# EAGLE design borg16ctrl-V2 (EAGLE 4.16)
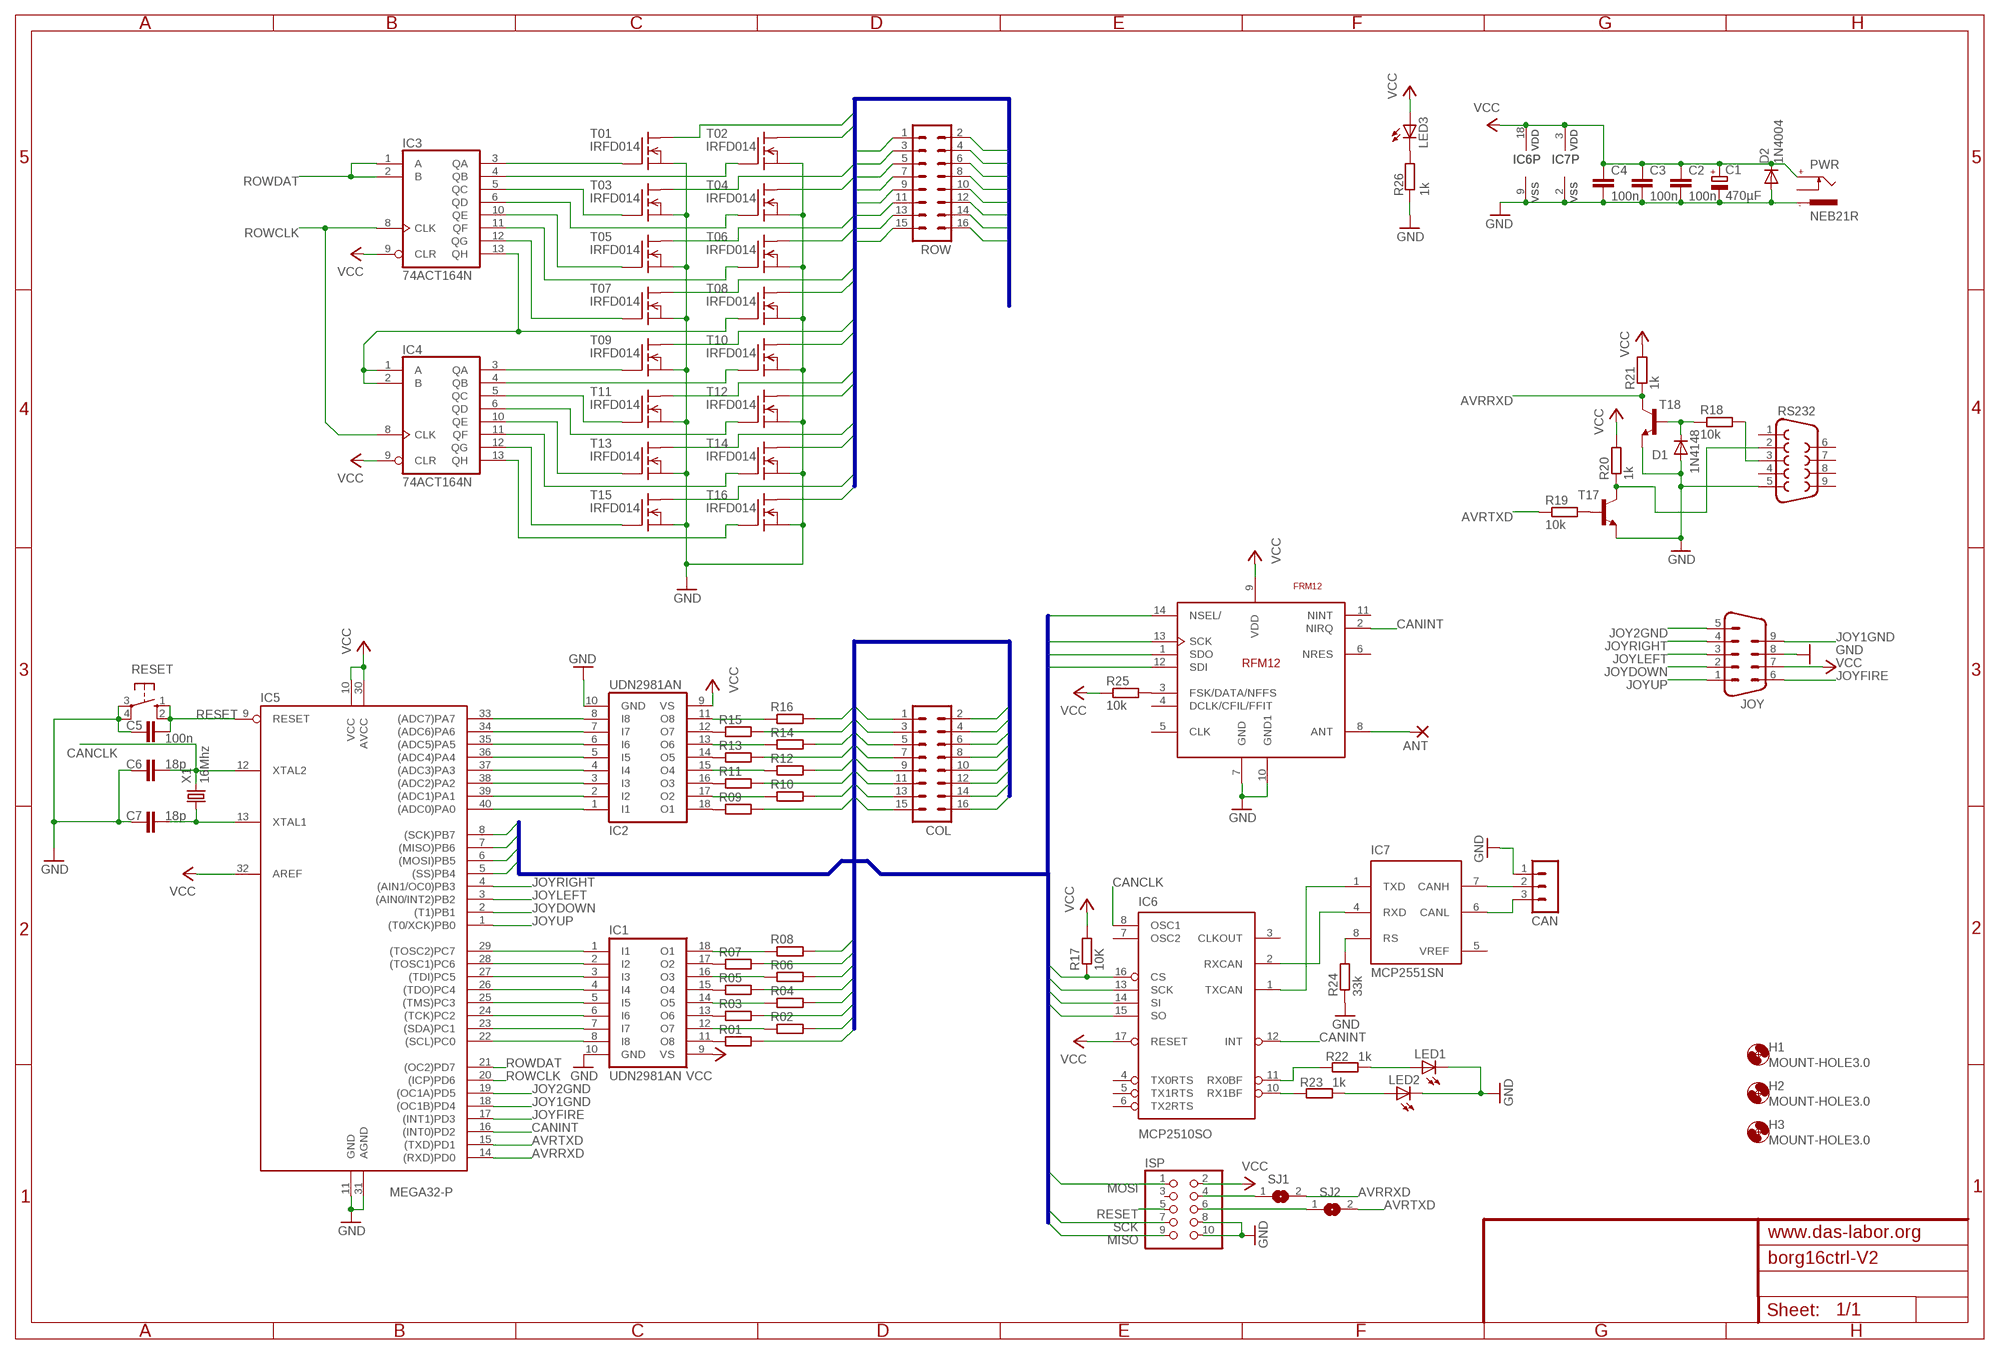
[diagram p0: schematic, sheet 1]

## Parts
ANT  2,54/1,0  [2,54/1,0]
C1  470µF  CPOL-EUE3.5-8  [E3,5-8]
C2  100n  C-EU025-025X050  [C025-025X050]
C3  100n  C-EU025-025X050  [C025-025X050]
C4  100n  C-EU025-025X050  [C025-025X050]
C5  100n  C-EU025-025X050  [C025-025X050]
C6  18p  C-EU025-025X050  [C025-025X050]
C7  18p  C-EU025-025X050  [C025-025X050]
CAN  MA03-1  [MA03-1]
COL  ML16  [ML16]
D1  1N4148  DIODE-D-2.5  [D-2.5]
D2  1N4004  [DO41-10]
H1  MOUNT-HOLE3.0  [3,0]
H2  MOUNT-HOLE3.0  [3,0]
H3  MOUNT-HOLE3.0  [3,0]
IC1  UDN2981AN  [DIL18]
IC2  UDN2981AN  [DIL18]
IC3  74ACT164N  [DIL14]
IC4  74ACT164N  [DIL14]
IC5  MEGA32-P  [DIL40]
IC6  MCP2510SO  [SO-18W]
IC7  MCP2551SN  [SO-08]
IC8  FRM12  [RFM12]
ISP  PINHD-2X5  [2X05]
JOY  M09HP  [M09HP]
LED1  LED5MM  [LED5MM]
LED2  LED5MM  [LED5MM]
LED3  LED3MM  [LED3MM]
PWR  NEB21R  [NEB21R]
R01  R-EU_0204/7  [0204/7]
R02  R-EU_0204/7  [0204/7]
R03  R-EU_0204/7  [0204/7]
R04  R-EU_0204/7  [0204/7]
R05  R-EU_0204/7  [0204/7]
R06  R-EU_0204/7  [0204/7]
R07  R-EU_0204/7  [0204/7]
R08  R-EU_0204/7  [0204/7]
R09  R-EU_0204/7  [0204/7]
R10  R-EU_0204/7  [0204/7]
R11  R-EU_0204/7  [0204/7]
R12  R-EU_0204/7  [0204/7]
R13  R-EU_0204/7  [0204/7]
R14  R-EU_0204/7  [0204/7]
R15  R-EU_0204/7  [0204/7]
R16  R-EU_0204/7  [0204/7]
R17  10K  R-EU_0204/7  [0204/7]
R18  10k  R-EU_0204/7  [0204/7]
R19  10k  R-EU_0204/7  [0204/7]
R20  1k  R-EU_0204/7  [0204/7]
R21  1k  R-EU_0204/7  [0204/7]
R22  1k  R-EU_0204/7  [0204/7]
R23  1k  R-EU_0204/7  [0204/7]
R24  33k  R-EU_R1206  [R1206]
R25  10k  R-EU_0204/7  [0204/7]
R26  1k  R-EU_0204/7  [0204/7]
RESET  10-XX  [B3F-10XX]
ROW  ML16  [ML16]
RS232  F09HP  [F09HP]
SJ1  SJ  [SJ]
SJ2  SJ  [SJ]
T01  IRFD014  [DIL04]
T02  IRFD014  [DIL04]
T03  IRFD014  [DIL04]
T04  IRFD014  [DIL04]
T05  IRFD014  [DIL04]
T06  IRFD014  [DIL04]
T07  IRFD014  [DIL04]
T08  IRFD014  [DIL04]
T09  IRFD014  [DIL04]
T10  IRFD014  [DIL04]
T11  IRFD014  [DIL04]
T12  IRFD014  [DIL04]
T13  IRFD014  [DIL04]
T14  IRFD014  [DIL04]
T15  IRFD014  [DIL04]
T16  IRFD014  [DIL04]
T17  BC547B-NPN-TO92-EBC  [TO92-EBC]
T18  BC547B-NPN-TO92-EBC  [TO92-EBC]
X1  16Mhz  CRYTALHC49U-V  [HC49U-V]

## Nets
$34: IC1.14(O5) R04.1
AVRRXD: IC5.14((RXD)PD0) R21.1 SJ1.2 T18.C
AVRTXD: IC5.15((TXD)PD1) R19.1 SJ2.2
CANCLK: C6.2 IC5.12(XTAL2) IC6.8(OSC1) X1.2
CANINT: IC5.16((INT0)PD2) IC6.12(INT) IC8.2(NIRQ)
COL1: COL.1 R01.2
COL2: COL.2 R02.2
COL3: COL.3 R03.2
COL4: COL.4 R04.2
COL5: COL.5 R05.2
COL6: COL.6 R06.2
COL7: COL.7 R07.2
COL8: COL.8 R08.2
COL9: COL.9 R09.2
COL10: COL.10 R10.2
COL11: COL.11 R11.2
COL12: COL.12 R12.2
COL13: COL.13 R13.2
COL14: COL.14 R14.2
COL15: COL.15 R15.2
COL16: COL.16 R16.2
FET11: IC4.4(QB) T10.3(G)
GND: C1.- C2.2 C3.2 C4.2 C5.1 C6.1 C7.1 CAN.1 D1.A D2.A IC1.10(GND) IC2.10(GND) IC5.11(GND) IC5.31(AGND) IC6.9(VSS) IC7.2(VSS) IC8.7(GND) IC8.10(GND1) ISP.8 ISP.10 JOY.8 LED1.K(C) LED2.K(C) PWR.- R24.1 R26.1 RESET.3(P) RESET.4(P1) RS232.5 T01.4(S) T02.4(S) T03.4(S) T04.4(S) T05.4(S) T06.4(S) T07.4(S) T08.4(S) T09.4(S) T10.4(S) T11.4(S) T12.4(S) T13.4(S) T14.4(S) T15.4(S) T16.4(S) T17.E T18.E
IC7: IC6.2(RXCAN) IC7.4(RXD)
JOY1GND: IC5.18((OC1B)PD4) JOY.9
JOY2GND: IC5.19((OC1A)PD5) JOY.5
JOYDOWN: IC5.2((T1)PB1) JOY.2
JOYFIRE: IC5.17((INT1)PD3) JOY.6
JOYLEFT: IC5.3((AIN0/INT2)PB2) JOY.3
JOYRIGHT: IC5.4((AIN1/OC0)PB3) JOY.4
JOYUP: IC5.1((T0/XCK)PB0) JOY.1
MISO: IC5.7((MISO)PB6) IC6.15(SO) IC8.1(SDO) ISP.9
MOSI: IC5.6((MOSI)PB5) IC6.14(SI) IC8.12(SDI) ISP.1
N$1: IC1.1(I1) IC5.29((TOSC2)PC7)
N$2: IC1.2(I2) IC5.28((TOSC1)PC6)
N$3: IC1.3(I3) IC5.27((TDI)PC5)
N$4: IC1.4(I4) IC5.26((TDO)PC4)
N$5: IC1.5(I5) IC5.25((TMS)PC3)
N$6: IC1.6(I6) IC5.24((TCK)PC2)
N$7: IC1.7(I7) IC5.23((SDA)PC1)
N$8: IC1.8(I8) IC5.22((SCL)PC0)
N$9: IC2.1(I1) IC5.40((ADC0)PA0)
N$10: IC2.2(I2) IC5.39((ADC1)PA1)
N$11: IC2.3(I3) IC5.38((ADC2)PA2)
N$12: IC2.4(I4) IC5.37((ADC3)PA3)
N$13: IC2.5(I5) IC5.36((ADC4)PA4)
N$14: IC2.6(I6) IC5.35((ADC5)PA5)
N$15: IC2.7(I7) IC5.34((ADC6)PA6)
N$16: IC2.8(I8) IC5.33((ADC7)PA7)
N$17: IC1.17(O2) R07.1
N$18: IC1.15(O4) R05.1
N$19: IC1.13(O6) R03.1
N$20: IC1.11(O8) R01.1
N$21: IC2.18(O1) R09.1
N$22: IC2.16(O3) R11.1
N$23: IC2.14(O5) R13.1
N$24: IC2.12(O7) R15.1
N$25: IC2.11(O8) R16.1
N$26: IC2.13(O6) R14.1
N$27: IC2.15(O4) R12.1
N$28: IC2.17(O2) R10.1
N$29: D1.C R18.1 T18.B
N$30: IC1.16(O3) R06.1
N$31: ISP.4 SJ1.1
N$32: IC1.12(O7) R02.1
N$33: IC3.3(QA) T01.3(G)
N$34: IC3.4(QB) T02.3(G)
N$35: IC3.5(QC) T03.3(G)
N$36: IC3.6(QD) T04.3(G)
N$37: IC3.10(QE) T05.3(G)
N$38: IC3.11(QF) T06.3(G)
N$39: IC3.12(QG) T07.3(G)
N$40: IC3.13(QH) IC4.1(A) IC4.2(B) T08.3(G)
N$41: IC4.3(QA) T09.3(G)
N$42: R18.2 RS232.3
N$43: IC4.5(QC) T11.3(G)
N$44: IC4.6(QD) T12.3(G)
N$45: IC4.10(QE) T13.3(G)
N$46: IC4.11(QF) T14.3(G)
N$47: IC4.12(QG) T15.3(G)
N$48: IC4.13(QH) T16.3(G)
N$49: LED1.A R22.2
N$50: LED2.A R23.2
N$51: IC6.10(RX1BF) R23.1
N$52: IC6.11(RX0BF) R22.1
N$53: CAN.2 IC7.7(CANH)
N$54: IC6.1(TXCAN) IC7.1(TXD)
N$55: IC8.3(FSK/DATA/NFFS) R25.2
N$56: IC7.8(RS) R24.2
N$57: CAN.3 IC7.6(CANL)
N$58: ISP.6 SJ2.1
N$59: C7.2 IC5.13(XTAL1) X1.1
N$60: R20.1 RS232.2 T17.C
N$61: R19.2 T17.B
N$62: LED3.K(C) R26.2
N$63: ANT.1(P) IC8.8(ANT)
R08: IC1.18(O1) R08.1
RESET: C5.2 IC5.9(RESET) ISP.5 RESET.1(S) RESET.2(S1)
ROW1: ROW.1 T01.2(D1)
ROW2: ROW.2 T02.2(D1)
ROW3: ROW.3 T03.2(D1)
ROW4: ROW.4 T04.2(D1)
ROW5: ROW.5 T05.2(D1)
ROW6: ROW.6 T06.2(D1)
ROW7: ROW.7 T07.2(D1)
ROW8: ROW.8 T08.2(D1)
ROW9: ROW.9 T09.2(D1)
ROW10: ROW.10 T10.2(D1)
ROW11: ROW.11 T11.2(D1)
ROW12: ROW.12 T12.2(D1)
ROW13: ROW.13 T13.2(D1)
ROW14: ROW.14 T14.2(D1)
ROW15: ROW.15 T15.2(D1)
ROW16: ROW.16 T16.2(D1)
ROWCLK: IC3.8(CLK) IC4.8(CLK) IC5.20((ICP)PD6)
ROWDAT: IC3.1(A) IC3.2(B) IC5.21((OC2)PD7)
SCK: IC5.8((SCK)PB7) IC6.13(SCK) IC8.13(SCK) ISP.7
SS: IC5.5((SS)PB4) IC6.16(CS) IC8.14(NSEL/) R17.1
VCC: C1.+ C2.1 C3.1 C4.1 D2.C IC1.9(VS) IC2.9(VS) IC3.9(CLR) IC4.9(CLR) IC5.10(VCC) IC5.30(AVCC) IC5.32(AREF) IC6.17(RESET) IC6.18(VDD) IC7.3(VDD) IC8.9(VDD) ISP.2 JOY.7 LED3.A PWR.+ R17.2 R20.2 R21.2 R25.1
Unconnected: IC6.3(CLKOUT) IC6.4(TX0RTS) IC6.5(TX1RTS) IC6.6(TX2RTS) IC6.7(OSC2) IC8.4(DCLK/CFIL/FFIT) IC8.5(CLK) IC8.6(NRES) IC8.11(NINT) ISP.3 PWR.C RS232.1 RS232.4 RS232.6 RS232.7 RS232.8 RS232.9 T01.1(D) T02.1(D) T03.1(D) T04.1(D) T05.1(D) T06.1(D) T07.1(D) T08.1(D) T09.1(D) T10.1(D) T11.1(D) T12.1(D) T13.1(D) T14.1(D) T15.1(D) T16.1(D)

## Buses
COLUMS:COL1,COL2,COL3,COL4,COL5,COL6,COL7,COL8,COL9,COL10,COL11,COL12,COL13,COL14,COL15,COL16
ROWS:ROW1,ROW2,ROW3,ROW4,ROW5,ROW6,ROW7,ROW8,ROW9,ROW10,ROW11,ROW12,ROW13,ROW14,ROW15,ROW16
SPI:SCK,MISO,MOSI,SS

## Notes on the sheet
- www.das-labor.org

## Power pins joined to a net without a drawn wire
GND: IC3.7(GND) IC4.7(GND)
VCC: IC3.14(VCC) IC4.14(VCC)
VREF: IC7.5(VREF)

## Library data of the parts
ANT = wirepad:2,54/1,0: THROUGH-HOLE PAD
C1 = rcl:CPOL-EU: POLARIZED CAPACITOR, European symbol
C2-C7 = rcl:C-EU: CAPACITOR, European symbol
CAN = con-lstb:MA03-1: PIN HEADER
COL ROW = con-harting-ml:ML16: HARTING
D1 = diode:DIODE-: DIODE
D2 = diode:1N4004: DIODE general purpose rectifier, 1 A
H1-H3 = holes:MOUNT-HOLE: MOUNTING HOLE with drill center marker
IC1 IC2 = uln-udn:UDN2981A: DRIVER ARRAY
IC3 IC4 = 74xx-eu:74*164: 8-bit parallel out SHIFT REGISTER
IC5 = atmel:MEGA32-P: MICROCONTROLLER 32 Kbytes FLASH 2 Kbytes SRAM 1 Kbytes EEPROM USART 8-channel 10 bit ADC
IC6 = microchip_can:MCP2510
IC7 = microchip_can:MCP2551: High Speed CAN tranceiver
IC8 = RFM12:FRM12
ISP = pinhead:PINHD-2X5: PIN HEADER
JOY = con-subd:M09: SUB-D
LED1-LED3 = led:LED: LED OSRAM: - CHIPLED LG R971, LG N971, LY N971, LG Q971, LY Q971, LO R971, LY R971 LH N974, LH R974 LS Q976, LO Q976, LY Q976 LO Q996 - Hyper CHIPLED LW Q18S LB Q993, LB Q99A, LB R99A - SideLED LS A670, LO A670, LY A670, LG A670, LP A670 LB A673, LV A673, LT A673, LW A673 LH A674 LY A675 LS A676, LA A676, LO A676, LY A676, LW A676 LS A679, LY A679, LG A679 - Hyper Micro SIDELED® LS Y876, LA Y876, LO Y876, LY Y876 LT Y87S - SmartLED LW L88C, LW L88S LB L89C, LB L89S, LG L890 LS L89K, LO L89K, LY L89K LS L896, LA L896, LO L896, LY L896 - TOPLED LS T670, LO T670, LY T670, LG T670, LP T670 LSG T670, LSP T670, LSY T670, LOP T670, LYG T670 LG T671, LOG T671, LSG T671 LB T673, LV T673, LT T673, LW T673 LH T674 LS T676, LA T676, LO T676, LY T676, LB T676, LH T676, LSB T676, LW T676 LB T67C, LV T67C, LT T67C, LS T67K, LO T67K, LY T67K, LW E67C LS E67B, LA E67B, LO E67B, LY E67B, LB E67C, LV E67C, LT E67C LW T67C LS T679, LY T679, LG T679 LS T770, LO T770, LY T770, LG T770, LP T770 LB T773, LV T773, LT T773, LW T773 LH T774 LS E675, LA E675, LY E675, LS T675 LS T776, LA T776, LO T776, LY T776, LB T776 LHGB T686 LT T68C, LB T68C - Hyper Mini TOPLED® LB M676 - Mini TOPLED Santana® LG M470 LS M47K, LO M47K, LY M47K Source: http://www.osram.convergy.de/
PWR = con-lumberg:NEB21R: Klinkeneinbaukupplung
R01-R09 R10-R26 = rcl:R-EU_: RESISTOR, European symbol
RESET = switch-omron:10-XX: OMRON SWITCH
RS232 = con-subd:F09: SUB-D
SJ1 SJ2 = jumper:SJ: SMD solder JUMPER
T01-T09 T10-T16 = irfd014:IRFD014
T17 T18 = transistor:*-NPN-: NPN Transistror
X1 = crystal:CRYTAL: CRYSTAL

## Board
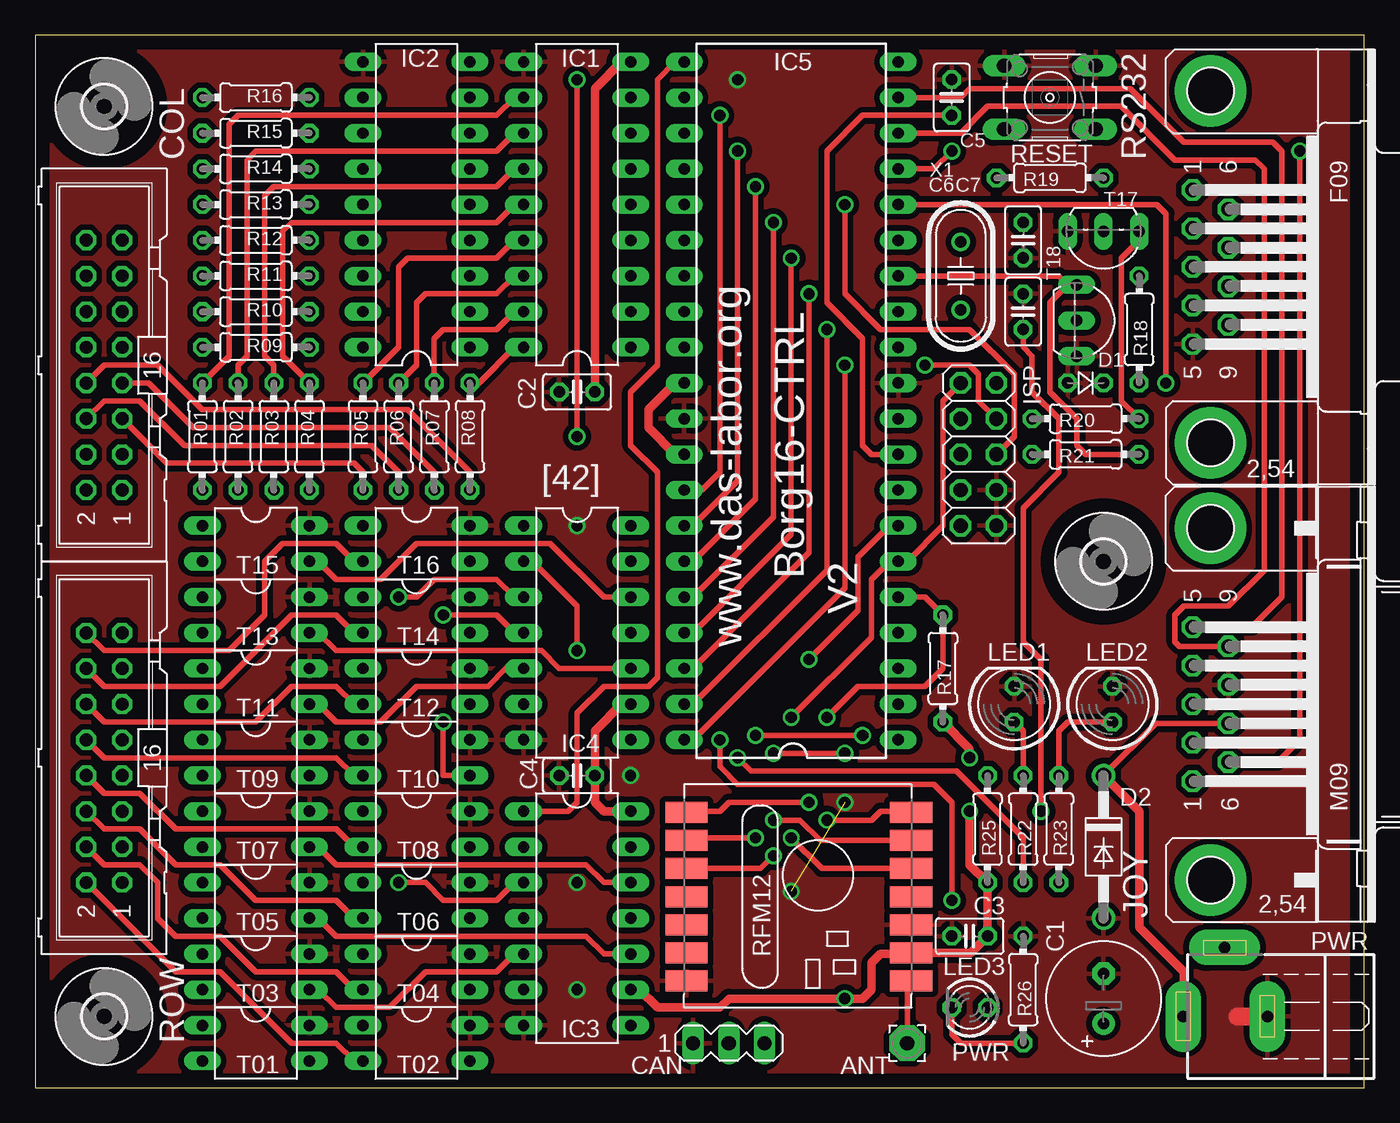
[diagram p1: board, top side]
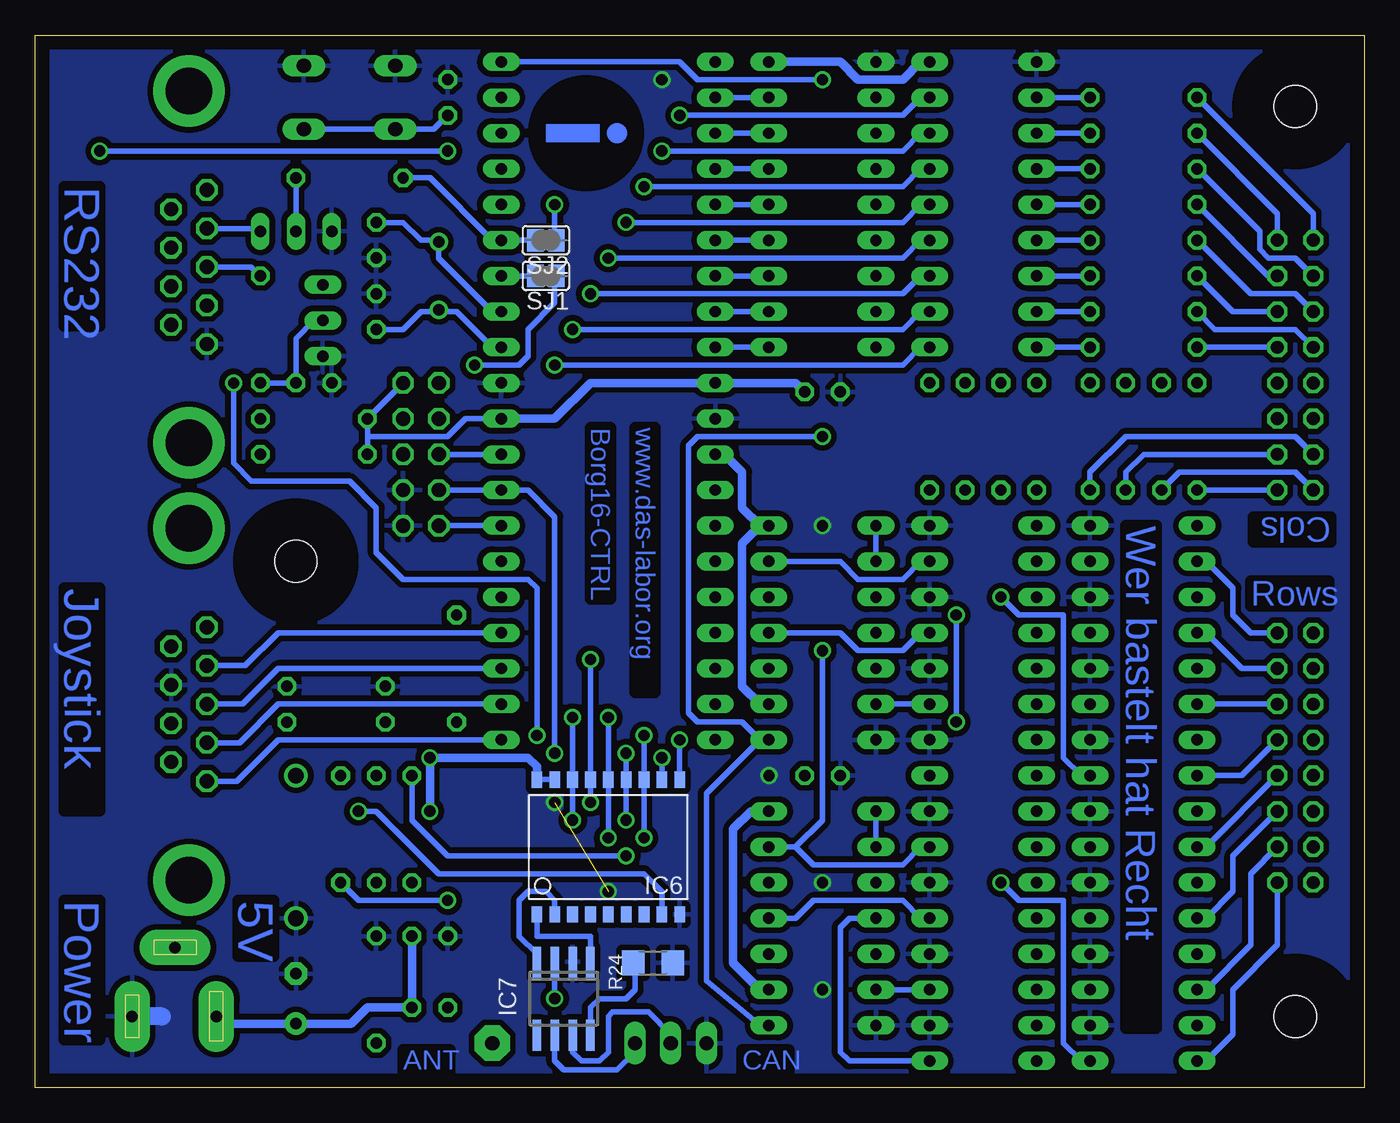
[diagram p2: board, bottom side, seen from below]

Size 94.6 x 74.92 mm. Coordinates in mm from the lower left corner, seen from the top.
Outline: 0,0 94.6,0 94.6,74.92 0,74.92 0,0
Copper layers (1*16): Top 0.035mm / dielectric 1.5mm / Bottom 0.035mm
Design rules "default": minimum track width 10mil, minimum drill 24mil, track to track 8mil, track to pad 8mil, pad to pad 8mil, via to via 8mil, smd to smd 8mil, copper to edge 40mil, drill to drill 8mil, minimum pad ring 10mil, minimum via ring 8mil, stop-mask expansion 4mil, vias tented up to drill 0mil, thermal gap 16mil
bRestrict: area 51.7,64.2 to 59.1,71.7

### Footprints (pad centres in the part's own frame; a part is rotated, then mirrored left to right if it is on the bottom)
2,54/1,0 = drill 1.016 pad 2.54 octagon: 1 0,0
E3,5-8 = drill 0.813 pad 1.6 round: + -1.778,0 | drill 0.813 pad 1.6 octagon: - 1.778,0
C025-025X050 = drill 0.813 octagon: 1 -1.27,0; 2 1.27,0
MA03-1 = drill 1.016 long: 1 -2.54,0; 2 0,0; 3 2.54,0
ML16 = drill 0.914 octagon: 1 -8.89,-1.27; 2 -8.89,1.27; 3 -6.35,-1.27; 4 -6.35,1.27; 5 -3.81,-1.27; 6 -3.81,1.27; 7 -1.27,-1.27; 8 -1.27,1.27; 9 1.27,-1.27; 10 1.27,1.27; 11 3.81,-1.27; 12 3.81,1.27; 13 6.35,-1.27; 14 6.35,1.27; 15 8.89,-1.27; 16 8.89,1.27
D-2.5 = drill 0.813 octagon: A 1.27,0; C -1.27,0
DO41-10 = drill 1.118 round: A 5.08,0; C -5.08,0
3,0 = hole 3: 0,0
DIL18 = drill 0.813 long: 1 -10.16,-3.81; 2 -7.62,-3.81; 3 -5.08,-3.81; 4 -2.54,-3.81; 5 0,-3.81; 6 2.54,-3.81; 7 5.08,-3.81; 8 7.62,-3.81; 9 10.16,-3.81; 10 10.16,3.81; 11 7.62,3.81; 12 5.08,3.81; 13 2.54,3.81; 14 0,3.81; 15 -2.54,3.81; 16 -5.08,3.81; 17 -7.62,3.81; 18 -10.16,3.81
DIL14 = drill 0.813 long: 1 -7.62,-3.81; 2 -5.08,-3.81; 3 -2.54,-3.81; 4 0,-3.81; 5 2.54,-3.81; 6 5.08,-3.81; 7 7.62,-3.81; 8 7.62,3.81; 9 5.08,3.81; 10 2.54,3.81; 11 0,3.81; 12 -2.54,3.81; 13 -5.08,3.81; 14 -7.62,3.81
DIL40 = drill 0.813 long: 1 -24.13,-7.62; 2 -21.59,-7.62; 3 -19.05,-7.62; 4 -16.51,-7.62; 5 -13.97,-7.62; 6 -11.43,-7.62; 7 -8.89,-7.62; 8 -6.35,-7.62; 9 -3.81,-7.62; 10 -1.27,-7.62; 11 1.27,-7.62; 12 3.81,-7.62; 13 6.35,-7.62; 14 8.89,-7.62; 15 11.43,-7.62; 16 13.97,-7.62; 17 16.51,-7.62; 18 19.05,-7.62; 19 21.59,-7.62; 20 24.13,-7.62; 21 24.13,7.62; 22 21.59,7.62; 23 19.05,7.62; 24 16.51,7.62; 25 13.97,7.62; 26 11.43,7.62; 27 8.89,7.62; 28 6.35,7.62; 29 3.81,7.62; 30 1.27,7.62; 31 -1.27,7.62; 32 -3.81,7.62; 33 -6.35,7.62; 34 -8.89,7.62; 35 -11.43,7.62; 36 -13.97,7.62; 37 -16.51,7.62; 38 -19.05,7.62; 39 -21.59,7.62; 40 -24.13,7.62
SO-18W = smd 0.762 x 1.143: 1 -5.08,-4.788; 2 -3.81,-4.788; 3 -2.54,-4.788; 4 -1.27,-4.788; 5 0,-4.788; 6 1.27,-4.788; 7 2.54,-4.788; 8 3.81,-4.788; 9 5.08,-4.788; 10 5.08,4.788; 11 3.81,4.788; 12 2.54,4.788; 13 1.27,4.788; 14 0,4.788; 15 -1.27,4.788; 16 -2.54,4.788; 17 -3.81,4.788; 18 -5.08,4.788
SO-08 = smd 0.6 x 2.2: 1 -1.905,-2.6; 2 -0.635,-2.6; 3 0.635,-2.6; 4 1.905,-2.6; 5 1.905,2.6; 6 0.635,2.6; 7 -0.635,2.6; 8 -1.905,2.6
RFM12 = smd 1.5 x 3: 1 -5,-10; 2 -3,-10; 3 -1,-10; 4 1,-10; 5 3,-10; 6 5,-10; 7 7,-10; 8 7,6; 9 5,6; 10 3,6; 11 1,6; 12 -1,6; 13 -3,6; 14 -5,6
2X05 = drill 1.016 octagon: 1 -5.08,-1.27; 2 -5.08,1.27; 3 -2.54,-1.27; 4 -2.54,1.27; 5 0,-1.27; 6 0,1.27; 7 2.54,-1.27; 8 2.54,1.27; 9 5.08,-1.27; 10 5.08,1.27
M09HP = drill 1.016 octagon: 1 -5.486,1.27; 2 -2.743,1.27; 3 0,1.27; 4 2.743,1.27; 5 5.486,1.27; 6 -4.115,-1.27; 7 -1.372,-1.27; 8 1.372,-1.27; 9 4.115,-1.27 | drill 3.302 pad 5.08 round: G1 -12.522,0; G2 12.522,0
LED5MM = drill 0.813 octagon: A -1.27,0; K 1.27,0
LED3MM = drill 0.813 octagon: A -1.27,0; K 1.27,0
NEB21R = drill 0.813 pad 2.54 long: + 0,7.35; - 0,1.35; C 4.9,4.4
0204/7 = drill 0.813 octagon: 1 -3.81,0; 2 3.81,0
R1206 = smd 1.6 x 1.8: 1 -1.4,0; 2 1.4,0
B3F-10XX = drill 1.016 long: 1 -3.251,2.261; 2 3.251,2.261; 3 -3.251,-2.261; 4 3.251,-2.261
F09HP = drill 1.016 octagon: 1 -5.486,-1.27; 2 -2.743,-1.27; 3 0,-1.27; 4 2.743,-1.27; 5 5.486,-1.27; 6 -4.115,1.27; 7 -1.372,1.27; 8 1.372,1.27; 9 4.115,1.27 | drill 3.302 pad 5.08 round: G1 -12.522,0; G2 12.522,0
SJ = smd 1.168 x 1.6: 1 -0.762,0; 2 0.762,0
DIL04 = drill 0.813 long: 1 -1.27,-3.81; 2 1.27,-3.81; 3 1.27,3.81; 4 -1.27,3.81
TO92-EBC = drill 0.813 long: B 0,-1.27; C -2.54,-1.27; E 2.54,-1.27
HC49U-V = drill 0.813 round: 1 -2.413,0; 2 2.413,0

### Placement (x,y rotation side)
ANT  62.06,3.17 0 top
C1  76.03,6.34 90 top
C2  38.57,49.52 180 top
C3  66.51,10.79 180 top
C4  38.57,22.22 180 top
C5  65.24,70.48 270 top
C6  70.32,55.24 270 top
C7  70.32,60.32 90 top
CAN  49.37,3.17 0 top
COL  4.92,51.43 90 top
D1  74.77,50.16 180 top
D2  76.03,17.14 270 top
H1  4.92,69.84 0 top
H2  4.92,5.08 0 top
H3  76.03,37.46 0 top
IC1  38.57,62.86 90 top
IC2  27.14,62.86 90 top
IC3  38.57,12.06 270 top
IC4  38.57,32.38 270 top
IC5  53.81,48.89 90 top
IC6  53.81,17.14 0 bottom
IC7  56.98,6.34 180 bottom
IC8  56.35,14.6 270 top
ISP  67.14,45.08 270 top
JOY  83.66,27.3 90 top
LED1  69.69,27.3 90 top
LED2  76.67,27.3 90 top
LED3  66.51,5.71 180 top
PWR  89.05,5.08 90 top
R01  11.9,46.35 270 top
R02  14.44,46.35 270 top
R03  16.98,46.35 270 top
R04  19.52,46.35 270 top
R05  23.33,46.35 270 top
R06  25.87,46.35 270 top
R07  28.41,46.35 270 top
R08  30.95,46.35 270 top
R09  15.71,52.7 180 top
R10  15.71,55.24 180 top
R11  15.71,57.78 180 top
R12  15.71,60.32 180 top
R13  15.71,62.86 180 top
R14  15.71,65.4 180 top
R15  15.71,67.94 180 top
R16  15.71,70.48 180 top
R17  64.61,29.84 270 top
R18  78.58,53.97 90 top
R19  72.22,64.77 0 top
R20  74.77,47.62 180 top
R21  74.77,45.08 180 top
R22  70.32,18.41 90 top
R23  72.86,18.41 90 top
R24  50.63,8.88 180 bottom
R25  67.78,18.41 90 top
R26  70.32,6.98 270 top
RESET  72.22,70.48 180 top
ROW  4.92,23.49 90 top
RS232  83.66,58.41 270 top
SJ1  58.25,57.78 180 bottom
SJ2  58.25,60.32 180 bottom
T01  15.71,3.17 270 top
T02  27.14,3.17 270 top
T03  15.71,8.25 270 top
T04  27.14,8.25 270 top
T05  15.71,13.33 270 top
T06  27.14,13.33 270 top
T07  15.71,18.41 270 top
T08  27.14,18.41 270 top
T09  15.71,23.49 270 top
T10  27.14,23.49 270 top
T11  15.71,28.57 270 top
T12  27.14,28.57 270 top
T13  15.71,33.65 270 top
T14  27.14,33.65 270 top
T15  15.71,38.73 270 top
T16  27.14,38.73 270 top
T17  76.03,59.69 180 top
T18  75.4,54.61 270 top
X1  65.88,57.78 270 top

### Tracks (layer width: path | path; a pad name or v marks a point on that pad's centre or on a via)
$34
  Top 0.406: R04.1 17.61,52.06 17.61,60.95 18.25,61.59 32.85,61.59 34.12,62.86 IC1.14
AVRRXD
  Top 0.406: 73.5,57.15 72.22,55.88 72.22,49.52 74.13,47.62 74.13,45.72 74.77,45.08 R21.1 | 73.5,57.15 T18.C | 73.5,57.15 72.86,57.78 IC5.14
  Bottom 0.406: SJ1.2 IC5.14
AVRTXD
  Bottom 0.406: R19.1 66.51,64.77 62.06,60.32 IC5.15 SJ2.2
CANCLK  (via drill 0.8)
  Top 0.406: v71.59,19.68 71.59,30.48 70.32,31.75 70.32,41.27 72.86,43.81 72.86,47.62 70.95,49.52 70.95,52.06 70.32,52.7 C6.2
  Bottom 0.406: IC5.12 62.06,52.7 64.61,55.24 65.88,55.24 | C6.2 68.41,53.97 67.14,55.24 65.88,55.24 | 65.88,55.24 X1.2 | IC6.8 50,13.96 51.27,15.24 65.88,15.24 70.32,19.68 v71.59,19.68
CANINT  (via drill 0.8)
  Top 0.406: IC5.16 79.84,62.86 80.48,62.23 v80.48,50.16 | v51.27,25.08 v58.89,25.08 | IC8.2 46.19,17.6 46.19,17.78 v51.27,17.78
  Bottom 0.406: v80.48,50.16 80.48,44.45 79.21,43.17 72.22,43.17 70.32,41.27 70.32,38.09 68.41,36.19 59.52,36.19 58.89,35.55 v58.89,25.08 | v51.27,17.78 IC6.12 v51.27,25.08
COL1
  Bottom 0.406: COL.1 R01.2
COL2
  Bottom 0.406: R02.2 13.17,43.81 4.92,43.81 COL.2
COL3
  Bottom 0.406: R03.2 16.98,43.81 15.71,45.08 COL.3
COL4
  Bottom 0.406: R04.2 19.52,43.81 16.98,46.35 4.92,46.35 COL.4
COL5
  Top 0.406: COL.5 9.36,44.45 22.7,44.45 23.33,43.81 R05.2
COL6
  Top 0.406: COL.6 4.92,48.89 7.46,48.89 10.63,45.72 23.96,45.72 25.87,43.81 R06.2
COL7
  Top 0.406: COL.7 8.09,50.16 11.27,46.98 25.23,46.98 28.41,43.81 R07.2
COL8
  Top 0.406: COL.8 4.92,51.43 8.73,51.43 11.9,48.26 26.5,48.26 30.95,43.81 R08.2
COL9
  Bottom 0.406: COL.9 R09.2
COL10
  Bottom 0.406: COL.10 4.92,53.97 10.63,53.97 R10.2
COL11
  Bottom 0.406: R11.2 9.36,55.24 COL.11
COL12
  Bottom 0.406: COL.12 4.92,56.51 8.09,56.51 R12.2
COL13
  Bottom 0.406: COL.13 6.82,57.78 R13.2
COL14
  Bottom 0.406: COL.14 4.92,59.05 6.82,59.05 7.46,59.69 7.46,60.95 R14.2
COL15
  Bottom 0.406: COL.15 6.18,62.23 R15.2
COL16
  Bottom 0.406: COL.16 3.64,62.23 R16.2
FET11  (via drill 0.8)
  Top 0.406: T10.3 29.04,22.22 v29.04,26.03 | v29.04,33.65 32.85,33.65 34.12,32.38 IC4.4
  Bottom 0.406: v29.04,26.03 v29.04,33.65
GND  (via drill 0.8)  (1 unrouted)
  Top 1.27: 85.56,5.08 87.47,5.08
  Bottom 1.27: 85.56,5.08 87.47,5.08
  other vias: 38.57,6.98 42.38,22.22 38.57,40 50,71.75 57.62,20.32 38.57,14.6 53.81,13.96
  pour Bottom (isolate 0.406): -0.17,-0.01 95.4,-0.01 95.4,74.92 -0.17,74.92
  pour Top (isolate 0.406): -0.17,74.92 95.4,74.92 95.4,-0.01 -0.17,-0.01
IC7
  Bottom 0.406: IC7.4 58.89,9.52 60.16,10.79 60.16,13.33 59.52,13.96 58.25,13.96 57.62,13.33 IC6.2 57.62,12.06
JOY1GND
  Top 0.406: IC5.18 65.88,67.94 67.78,69.84 77.3,69.84 81.11,66.03 86.83,66.03 87.47,65.4 87.47,36.83 84.92,34.29 81.75,34.29 81.11,33.65 81.11,31.75 81.44,31.41 JOY.9
JOY2GND
  Top 0.406: IC5.19 65.88,70.48 66.51,71.11 77.94,71.11 81.75,67.31 88.1,67.31 88.73,66.67 88.73,34.92 86.6,32.79 JOY.5
JOYDOWN
  Bottom 0.406: JOY.2 80.05,24.56 77.3,27.3 IC5.2
JOYFIRE  (via drill 0.8)
  Top 0.406: JOY.6 88.43,23.19 90,24.76 v90,66.67 | IC5.17 63.97,65.4 v65.24,66.67
  Bottom 0.406: v90,66.67 v65.24,66.67
JOYLEFT
  Bottom 0.406: IC5.3 77.3,29.84 79.84,27.3 JOY.3
JOYRIGHT
  Bottom 0.406: IC5.4 77.3,32.38 79.64,30.04 JOY.4
JOYUP
  Bottom 0.406: IC5.1 77.3,24.76 80.25,21.81 JOY.1
MISO  (via drill 0.8)
  Top 0.406: v55.08,30.48 58.57,33.97 58.57,37.78 60.8,40 IC5.7 | v55.08,20.32 49.37,20.32 48.73,19.68 46.19,19.68 46.27,19.6 IC8.1
  Bottom 0.406: IC5.7 ISP.9 | v55.08,30.48 IC6.15 v55.08,20.32
MOSI  (via drill 0.8)
  Top 0.406: v53.81,26.35 59.52,32.06 59.52,36.19 60.8,37.46 IC5.6 62.06,37.46 64.61,40 64.61,48.89 ISP.1 | IC8.12 55.98,15.6 v53.81,17.78
  Bottom 0.406: v53.81,17.78 IC6.14 v53.81,26.35
N$1
  Bottom 0.406: IC1.1 IC5.29
N$2
  Bottom 0.406: IC1.2 IC5.28
N$3
  Bottom 0.406: IC1.3 IC5.27
N$4
  Bottom 0.406: IC1.4 IC5.26
N$5
  Bottom 0.406: IC1.5 IC5.25
N$6
  Bottom 0.406: IC1.6 IC5.24
N$7
  Bottom 0.406: IC1.7 IC5.23
N$8
  Bottom 0.406: IC1.8 IC5.22
N$9  (via drill 0.8)
  Top 0.406: v57.62,51.43 57.62,35.55 46.82,24.76 IC5.40
  Bottom 0.406: IC2.1 31.58,52.7 32.85,51.43 v57.62,51.43
N$10  (via drill 0.8)
  Top 0.406: v56.35,53.97 56.35,36.83 46.82,27.3 IC5.39
  Bottom 0.406: IC2.2 31.58,55.24 32.85,53.97 v56.35,53.97
N$11  (via drill 0.8)
  Top 0.406: v55.08,56.51 55.08,38.09 46.82,29.84 IC5.38
  Bottom 0.406: IC2.3 31.58,57.78 32.85,56.51 v55.08,56.51
N$12  (via drill 0.8)
  Top 0.406: v53.81,59.05 53.81,39.37 46.82,32.38 IC5.37
  Bottom 0.406: IC2.4 31.58,60.32 32.85,59.05 v53.81,59.05
N$13  (via drill 0.8)
  Top 0.406: v52.54,61.59 52.54,40.63 46.82,34.92 IC5.36
  Bottom 0.406: IC2.5 31.58,62.86 32.85,61.59 v52.54,61.59
N$14  (via drill 0.8)
  Top 0.406: v51.27,64.13 51.27,41.91 46.82,37.46 IC5.35
  Bottom 0.406: IC2.6 31.58,65.4 32.85,64.13 v51.27,64.13
N$15  (via drill 0.8)
  Top 0.406: v50,66.67 50,43.17 46.82,40 IC5.34
  Bottom 0.406: IC2.7 31.58,67.94 32.85,66.67 v50,66.67
N$16  (via drill 0.8)
  Top 0.406: v48.73,69.21 48.73,43.81 47.46,42.54 IC5.33
  Bottom 0.406: IC2.8 31.58,70.48 32.85,69.21 v48.73,69.21
N$17
  Top 0.406: R07.1 28.41,53.34 29.04,53.97 32.85,53.97 34.12,55.24 IC1.17
N$18
  Top 0.406: R05.1 25.87,52.7 25.87,58.41 26.5,59.05 32.85,59.05 34.12,60.32 IC1.15
N$19
  Top 0.406: R03.1 16.98,51.43 16.34,52.06 16.34,63.49 16.98,64.13 32.85,64.13 34.12,65.4 IC1.13
N$20
  Top 0.406: R01.1 13.81,52.06 13.81,68.58 14.44,69.21 32.85,69.21 34.12,70.48 IC1.11
N$21
  Bottom 0.406: R09.1 IC2.18
N$22
  Bottom 0.406: R11.1 IC2.16
N$23
  Bottom 0.406: R13.1 IC2.14
N$24
  Bottom 0.406: R15.1 IC2.12
N$25
  Bottom 0.406: R16.1 IC2.11
N$26
  Bottom 0.406: R14.1 IC2.13
N$27
  Bottom 0.406: R12.1 IC2.15
N$28
  Bottom 0.406: R10.1 IC2.17
N$29
  Bottom 0.406: R18.1 D1.C 76.03,53.34 74.77,54.61 T18.B
N$30
  Top 0.406: R06.1 27.14,51.43 27.14,55.88 27.77,56.51 32.85,56.51 34.12,57.78 IC1.16
N$31  (via drill 0.8)
  Top 0.406: ISP.4 67.14,48.89 67.14,50.8 66.51,51.43 v63.34,51.43
  Bottom 0.406: SJ1.1 57.62,57.78 57.62,55.88 59.52,53.97 59.52,52.06 60.16,51.43 v63.34,51.43
N$32
  Top 0.406: IC1.12 34.12,67.94 32.85,66.67 15.71,66.67 15.08,66.03 15.08,52.06 14.44,51.43 R02.1
N$33  (via drill 0.8)
  Top 0.406: IC3.3 34.12,14.6 32.85,13.33 29.04,13.33 27.77,14.6 v25.87,14.6
  Bottom 0.406: v25.87,14.6 24.6,13.33 21.42,13.33 21.42,3.17 20.15,1.9 T01.3
N$34
  Bottom 0.406: T02.3 36.66,1.9 37.3,2.54 37.3,11.43 36.66,12.06 IC3.4
N$35
  Top 0.406: T03.3 20.15,6.98 21.42,5.71 25.23,5.71 27.77,8.25 32.85,8.25 34.12,9.52 IC3.5
N$36
  Bottom 0.406: T04.3 IC3.6
N$37
  Top 0.406: T05.3 20.15,12.06 21.42,10.79 39.2,10.79 40.48,9.52 IC3.10
N$38
  Bottom 0.406: T06.3 31.58,12.06 32.85,13.33 39.2,13.33 40.48,12.06 IC3.11
N$39
  Top 0.406: T07.3 20.15,17.14 21.42,15.87 39.2,15.87 40.48,14.6 IC3.12
N$40  (via drill 0.8)
  Top 0.406: IC4.2 35.39,37.46 38.57,34.29 v38.57,31.11
  Bottom 0.406: IC4.2 IC4.1 | T08.3 31.58,17.14 32.85,15.87 39.2,15.87 40.48,17.14 | 40.48,17.14 IC3.13 | 40.48,17.14 38.57,19.05 v38.57,31.11
N$41  (via drill 0.8)
  Top 0.406: IC4.3 34.12,34.92 32.85,36.19 28.41,36.19 27.14,34.92 v25.87,34.92
  Bottom 0.406: v25.87,34.92 24.6,33.65 21.42,33.65 21.42,23.49 20.15,22.22 T09.3
N$42
  Bottom 0.406: R18.2 79.21,58.41 RS232.3
N$43
  Top 0.406: IC4.5 33.49,29.84 32.22,28.57 27.14,28.57 24.6,26.03 21.42,26.03 20.15,27.3 T11.3
N$44
  Bottom 0.406: T12.3 IC4.6
N$45
  Top 0.406: T13.3 20.15,32.38 21.42,31.11 36.03,31.11 37.3,29.84 IC4.10
N$46
  Bottom 0.406: T14.3 31.58,32.38 32.85,31.11 36.03,31.11 37.3,32.38 IC4.11
N$47
  Top 0.406: T15.3 20.15,37.46 21.42,36.19 24.6,36.19 27.14,38.73 36.66,38.73 40.48,34.92 IC4.12
N$48
  Bottom 0.406: T16.3 31.58,37.46 32.85,36.19 36.03,36.19 37.3,37.46 IC4.13
N$49
  Top 0.406: R22.2 70.32,25.39 LED1.A
N$50
  Top 0.406: LED2.A 73.5,26.03 72.86,25.39 R23.2
N$51  (via drill 0.8)
  Top 0.406: v48.73,24.76 48.73,22.86 50,21.59 63.97,21.59 65.24,20.32 v65.24,13.33
  Bottom 0.406: IC6.10 v48.73,24.76 | v65.24,13.33 71.59,13.33 R23.1
N$52  (via drill 0.8)
  Top 0.406: v50,23.49 50.95,22.54 65.56,22.54 70.32,17.78 R22.1
  Bottom 0.406: IC6.11 v50,23.49
N$53
  Bottom 0.406: IC7.7 56.35,2.54 55.71,1.9 54.45,1.9 53.81,2.54 53.81,5.08 53.49,5.39 50.95,5.39 49.37,3.8 CAN.2
N$54
  Bottom 0.406: IC7.1 55.08,10.79 58.89,10.79 IC6.1 58.89,12.7
N$55  (via drill 0.8)
  Top 0.406: v52.54,16.5 51.63,15.6 IC8.3 46.35,15.71 46.19,15.87
  Bottom 0.406: R25.2 67.78,19.05 65.24,16.5 v52.54,16.5
N$56
  Bottom 0.406: IC7.8 55.08,5.71 54.45,6.34 52.54,6.34 51.91,6.98 51.91,8.88 R24.2
N$57
  Bottom 0.406: CAN.3 51.91,2.54 53.17,1.26 56.98,1.26 57.62,1.9 IC7.6 57.62,3.8
N$58  (via drill 0.8)
  Top 0.406: ISP.6 69.69,46.35 69.69,50.8 66.51,53.97 60.16,53.97 57.62,56.51 v57.62,62.86
  Bottom 0.406: v57.62,62.86 57.62,60.32 SJ2.1
N$59
  Bottom 0.406: IC5.13 62.06,55.24 65.88,59.05 65.88,60.32 | C7.2 68.41,61.59 67.14,60.32 65.88,60.32 | 65.88,60.32 X1.1
N$60
  Top 0.406: T17.C 78.58,60.32 77.3,59.05 77.3,48.89 R20.1
  Bottom 0.406: RS232.2 78.78,61.16 T17.C
N$61
  Bottom 0.406: T17.B R19.2
N$62
  Top 0.406: LED3.K 65.24,3.8 65.88,3.17 R26.2
N$63
  Top 0.406: IC8.8 62.08,7.6 62.06,7.61 ANT.1
R08
  Top 0.406: R08.1 31.58,50.16 34.12,52.7 IC1.18
RESET
  Top 0.406: C5.2 58.89,69.21 56.35,66.67 56.35,55.88 58.89,53.34 58.89,45.72 59.52,45.08 IC5.9
  Bottom 0.406: IC5.9 ISP.5 | C5.2 66.23,68.22 RESET.2 75.12,68.22 75.4,67.94 75.48,68.02 RESET.1
ROW1
  Bottom 0.406: ROW.1 6.18,10.16 9.36,6.98 9.36,3.8 11.27,1.9 T01.2
ROW2
  Top 0.406: ROW.2 10,8.25 13.17,8.25 18.25,3.17 21.42,3.17 22.7,1.9 T02.2
ROW3
  Bottom 0.406: ROW.3 8.09,15.24 8.09,10.16 11.27,6.98 T03.2
ROW4
  Top 0.406: ROW.4 4.92,15.87 7.46,15.87 8.73,14.6 8.73,12.06 10,10.79 13.17,10.79 15.71,8.25 21.42,8.25 22.7,6.98 T04.2
ROW5
  Bottom 0.406: ROW.5 9.36,16.5 9.36,13.96 11.27,12.06 T05.2
ROW6
  Top 0.406: ROW.6 4.92,18.41 7.46,18.41 10,15.87 13.17,15.87 15.71,13.33 21.42,13.33 22.7,12.06 T06.2
ROW7
  Bottom 0.406: ROW.7 11.27,17.14 T07.2
ROW8
  Top 0.406: T08.2 22.7,17.14 21.42,18.41 10,18.41 7.46,20.95 4.92,20.95 ROW.8
ROW9
  Bottom 0.406: T09.2 8.73,22.22 ROW.9
ROW10
  Top 0.406: T10.2 22.7,22.22 21.42,23.49 4.92,23.49 ROW.10
ROW11
  Bottom 0.406: ROW.11 T11.2
ROW12
  Top 0.406: ROW.12 4.92,26.03 15.71,26.03 18.25,28.57 21.42,28.57 22.7,27.3 T12.2
ROW13
  Bottom 0.406: ROW.13 8.73,29.84 11.27,32.38 T13.2
ROW14
  Top 0.406: ROW.14 4.92,28.57 13.17,28.57 18.25,33.65 21.42,33.65 22.7,32.38 T14.2
ROW15
  Bottom 0.406: ROW.15 8.09,32.38 9.36,33.65 9.36,35.55 11.27,37.46 T15.2
ROW16
  Top 0.406: ROW.16 4.92,31.11 13.81,31.11 16.34,33.65 16.34,37.46 17.61,38.73 21.42,38.73 22.7,37.46 T16.2
ROWCLK  (via drill 0.8)
  Top 0.406: v38.57,46.35 v38.57,71.75
  Bottom 0.406: 43.02,24.76 46.82,20.95 46.82,7.61 43.02,4.44 IC3.8 | IC5.20 48.73,73.02 47.46,71.75 v38.57,71.75 | 43.02,24.76 IC4.8 | 43.02,24.76 44.28,26.03 47.46,26.03 48.09,26.66 48.09,45.72 47.46,46.35 v38.57,46.35
ROWDAT
  Top 0.406: IC5.21 45.55,73.02 44.28,71.75 44.28,51.43 42.38,49.52 42.38,45.72 44.28,43.81 44.28,29.21 43.65,28.57 40.48,28.57 38.57,26.66 38.57,20.32 37.94,19.68 IC3.1
  Bottom 0.406: IC3.2 IC3.1
SCK  (via drill 0.8)
  Top 0.406: v52.54,23.81 v57.62,23.81 | IC8.13 55.89,17.6 54.45,19.05 v52.54,19.05
  Bottom 0.406: v57.62,23.81 57.62,40.63 59.52,42.54 IC5.8 ISP.7 | v52.54,19.05 IC6.13 v52.54,23.81
SS  (via drill 0.8)
  Top 0.406: IC5.5 63.34,34.92 R17.1 64.61,29.84 63.34,28.57 58.57,28.57 v56.35,26.35 | v56.35,19.05 59.52,19.05 60.16,19.68 62.06,19.68 62.14,19.6 IC8.14
  Bottom 0.406: v56.35,26.35 IC6.16 v56.35,19.05
VCC  (via drill 0.8)
  Top 0.406: JOY.7 79.74,25.93 D2.C | PWR.+ 81.75,5.08 | 62.06,9.52 62.14,9.6 IC8.9 | 41.74,73.02 IC1.9
  Top 0.61: IC3.14 40.48,19.68 39.84,20.32 C4.1 39.84,25.39 41.74,27.3 IC4.9 | IC5.32 45.55,45.08 43.65,46.98 43.65,48.26 45.55,50.16 IC5.30 | C2.1 39.84,71.11 41.74,73.02 | D2.C 78.58,19.68 78.58,11.43 81.75,8.25 81.75,5.08 | 62.06,9.52 60.16,9.52 59.52,8.88 59.52,6.98 58.89,6.34 v57.62,6.34 49.37,6.34 48.73,5.71 44.28,5.71 43.02,6.98 IC3.9 | v66.51,19.68 66.51,15.87 R25.1 C3.1 66.59,9.6 IC8.9 | v66.51,23.49 66.51,24.12 R17.2
  Bottom 0.406: IC5.10 63.97,47.62 65.24,46.35 70.95,46.35 R20.2 | R20.2 R21.2 | R20.2 ISP.2 | 81.75,5.08 PWR.+ | IC6.17 IC6.18 58.89,21.59 | v57.62,6.34 IC7.3
  Bottom 0.61: IC3.9 43.02,6.98 44.92,8.88 44.92,18.41 43.65,19.68 IC3.14 | IC2.9 31.58,73.02 32.85,71.75 36.03,71.75 37.3,73.02 IC1.9 | IC5.10 57.62,47.62 55.08,50.16 IC5.30 40.48,50.16 C2.1 | IC4.9 43.02,27.3 44.28,28.57 44.28,38.73 43.02,40 | 43.02,40 IC4.14 | 43.02,40 44.28,41.27 44.28,43.81 45.55,45.08 IC5.32 | 81.75,5.08 81.24,4.57 C1.+ 72.1,4.57 70.95,5.71 LED3.A C3.1 | v66.51,19.68 v66.51,23.49 59.52,23.49 58.89,22.86 IC6.18
(copper drawn outside any net)
  shapes: Bottom area x1, Bottom circle x1

### Text on the board
Bottom: RS232 | www.das-labor.org | Borg16-CTRL | Cols | Wer bastelt hat Recht | Joystick | Rows | 5V | Power | CAN | ANT
tPlace: PWR
tNames: www.das-labor.org | Borg16-CTRL | [42] | V2
bStop: [42]